# Altium schematic sheet Sheet1 V2.SchDoc
size A3; Date: 04.01.2021; Organization: Altium Limited; Address1: L3, 12a Rodborough Rd; Address2: Frenchs Forest; Address3: NSW; Address4: Australia 2086; SheetNumber: 1; SheetTotal: 2; Version: 1; Название устройства: TSAL_Main_Board
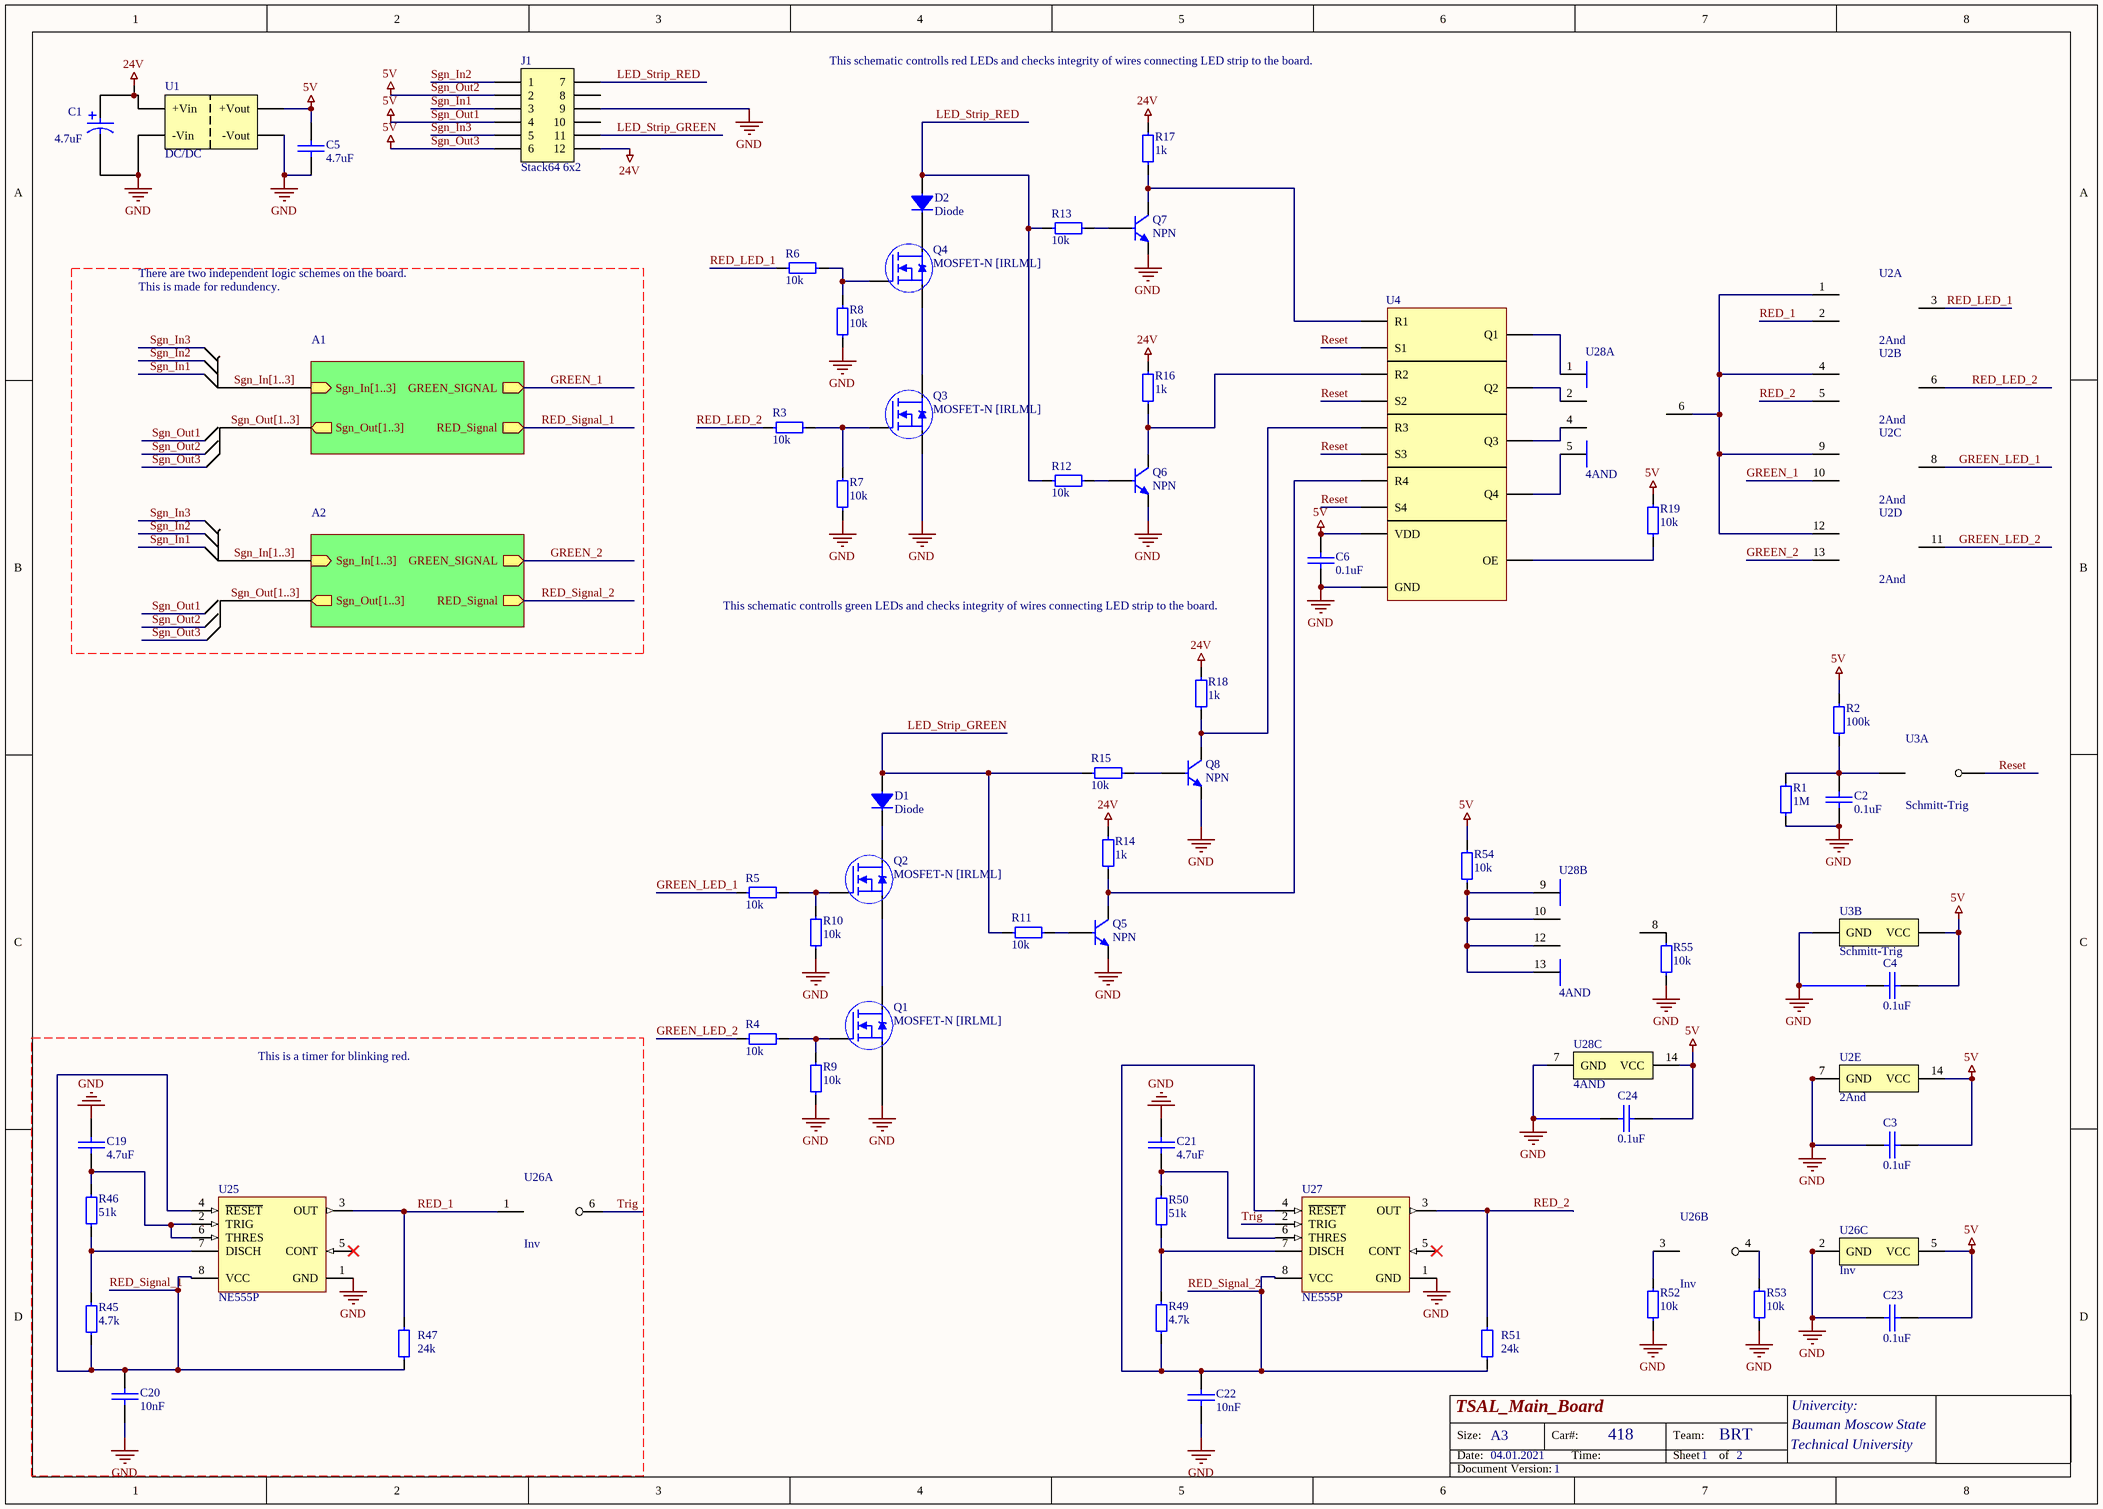
[diagram p0: Sheet1 V2.SchDoc]

## Parts
C1  4.7uF  [Bar Cap 4x5.4]
C2  0.1uF  [0603 Capicator]
C3  0.1uF  [0603 Capicator]
C4  0.1uF  [0603 Capicator]
C5  4.7uF  [0603 Capicator]
C6  0.1uF  [0603 Capicator]
C19  4.7uF  [0603 Capicator]
C20  10nF  [0603 Capicator]
C21  4.7uF  [0603 Capicator]
C22  10nF  [0603 Capicator]
C23  0.1uF  [0603 Capicator]
C24  0.1uF  [0603 Capicator]
D1  Diode  [DO-214AB(SMC)]
D2  Diode  [DO-214AB(SMC)]
J1  Stack64 6x2  [Conn6x2(Molex)]
Q1  MOSFET-N [IRLML]  [SOT-23]
Q2  MOSFET-N [IRLML]  [SOT-23]
Q3  MOSFET-N [IRLML]  [SOT-23]
Q4  MOSFET-N [IRLML]  [SOT-23]
Q5  NPN  [SOT-23]
Q6  NPN  [SOT-23]
Q7  NPN  [SOT-23]
Q8  NPN  [SOT-23]
R1  1M  [0603 Resistor]
R2  100k  [0603 Resistor]
R3  10k  [0603 Resistor]
R4  10k  [0603 Resistor]
R5  10k  [0603 Resistor]
R6  10k  [0603 Resistor]
R7  10k  [0603 Resistor]
R8  10k  [0603 Resistor]
R9  10k  [0603 Resistor]
R10  10k  [0603 Resistor]
R11  10k  [0603 Resistor]
R12  10k  [0603 Resistor]
R13  10k  [0603 Resistor]
R14  1k  [0603 Resistor]
R15  10k  [0805 Resistor]
R16  1k  [0603 Resistor]
R17  1k  [0603 Resistor]
R18  1k  [0603 Resistor]
R19  10k  [0603 Resistor]
R45  4.7k  [0603 Resistor]
R46  51k  [0603 Resistor]
R47  24k  [0805 Resistor]
R49  4.7k  [0603 Resistor]
R50  51k  [0603 Resistor]
R51  24k  [0805 Resistor]
R52  10k  [0603 Resistor]
R53  10k  [0603 Resistor]
R54  10k  [0603 Resistor]
R55  10k  [0603 Resistor]
U1  DC/DC  [SIP7]
U2  2And  [SOIC-14]  (parts A,B,C,D,E of 5)
U3  Schmitt-Trig  [SOT-23-5]  (parts A,B of 2)
U4  quad R/S latch with 3-state outputs  [SOIC-16]  (value not drawn)
U25  NE555P  [SOIC-8]
U26  Inv  [SOT236]  (parts A,B,C of 3)
U27  NE555P  [SOIC-8]
U28  4AND  [SOIC-14]  (parts A,B,C of 3)

## Sub-sheets
A1 = SignalReciever.SchDoc: RED_Signal (out), GREEN_SIGNAL (out), Sgn_In[1..3] (in), Sgn_Out[1..3] (out)
A2 = SignalReciever.SchDoc: RED_Signal (out), GREEN_SIGNAL (out), Sgn_In[1..3] (in), Sgn_Out[1..3] (out)

## Nets
24V: C1.2 J1.12 R14.2 R16.2 R17.2 R18.2 U1.1(+Vin)
GND: C1.1 C2.1 C3.1 C4.1 C5.1 C6.1 C19.2 C20.1 C21.2 C22.1 C23.1 C24.1 J1.9 Q1.2(Source) Q3.2(Source) Q5.2 Q6.2 Q7.2 Q8.2 R1.1 R7.1 R8.1 R9.1 R10.1 R52.1 R53.2 R55.2 U1.2(-Vin) U1.4(-Vout) U2.7(GND) U3.3(GND) U4.16(GND) U25.1(GND) U26.2(GND) U27.1(GND) U28.7(GND)
Sgn_Out1: C3.2 C4.2 C5.2 C6.2 C23.2 C24.2 J1.2 J1.4 J1.6 R2.2 R19.1 R54.1 U1.6(+Vout) U2.14(VCC) U3.5(VCC) U4.8(VDD) U26.5(VCC) U28.14(VCC)  [also labelled 5V, Sgn_Out2, Sgn_Out3]
GREEN_1: U2.10(3B) ; sheet A1/GREEN_SIGNAL
GREEN_2: U2.13(4B) ; sheet A2/GREEN_SIGNAL
GREEN_LED_1: R5.2 U2.8(3Y)
GREEN_LED_2: R4.2 U2.11(4Y)
LED_Strip_GREEN: D1.1 J1.11 R11.2 R15.2
LED_Strip_RED: D2.1 J1.7 R12.2 R13.2
RED_1: R47.2 U2.2(1B) U25.3(OUT) U26.1(1A)
RED_2: R51.2 U2.5(2B) U27.3(OUT)
RED_LED_1: R6.2 U2.3(1Y)
RED_LED_2: R3.2 U2.6(2Y)
RED_Signal_1: C20.2 R45.1 R47.1 U25.4(~{RESET}) U25.8(VCC) ; sheet A1/RED_Signal
RED_Signal_2: C22.2 R49.1 R51.1 U27.4(~{RESET}) U27.8(VCC) ; sheet A2/RED_Signal
Reset: U3.4(Y) U4.4(S1) U4.6(S2) U4.12(S3) U4.14(S4)
Sgn_In1: J1.3
Sgn_In2: J1.1
Sgn_In3: J1.5
Trig: U26.6(1Y) U27.2(TRIG)
NetC2_2: C2.2 R1.2 R2.1 U3.2(in)
NetC19_1: C19.1 R46.2 U25.2(TRIG) U25.6(THRES)
NetC21_1: C21.1 R50.2 U27.6(THRES)
NetD1_2: D1.2 Q2.3(Drain)
NetD2_2: D2.2 Q4.3(Drain)
NetQ1_1: Q1.1(Gate) R4.1 R9.2
NetQ1_3: Q1.3(Drain) Q2.2(Source)
NetQ2_1: Q2.1(Gate) R5.1 R10.2
NetQ3_1: Q3.1(Gate) R3.1 R7.2
NetQ3_3: Q3.3(Drain) Q4.2(Source)
NetQ4_1: Q4.1(Gate) R6.1 R8.2
NetQ5_1: Q5.1 R11.1
NetQ5_3: Q5.3 R14.1 U4.15(R4)
NetQ6_1: Q6.1 R12.1
NetQ6_3: Q6.3 R16.1 U4.7(R2)
NetQ7_1: Q7.1 R13.1
NetQ7_3: Q7.3 R17.1 U4.3(R1)
NetQ8_1: Q8.1 R15.1
NetQ8_3: Q8.3 R18.1 U4.11(R3)
NetR19_2: R19.2 U4.5(OE)
NetR45_2: R45.2 R46.1 U25.7(DISCH)
NetR49_2: R49.2 R50.1 U27.7(DISCH)
NetR52_2: R52.2 U26.3(2А)
NetR53_1: R53.1 U26.4(2Y)
NetR54_2: R54.2 U28.9(A) U28.10(B) U28.12(C) U28.13(D)
NetR55_1: R55.1 U28.8(Y)
NetU2_1: U2.1(1A) U2.4(2A) U2.9(3A) U2.12(4A) U28.6(Y)
NetU4_1: U4.1(Q4) U28.5(D)
NetU4_2: U4.2(Q1) U28.1(A)
NetU4_9: U4.9(Q2) U28.2(B)
NetU4_10: U4.10(Q3) U28.4(C)

Not connected (* = marked no-connect by the designer): J1 8 10; U25 5(CONT)*; U27 5(CONT)*

## Buses and harness runs
bus Sgn_In[1..3] = sheet A1/Sgn_In[1..3]
bus Sgn_In[1..3] = sheet A2/Sgn_In[1..3]
bus Sgn_Out[1..3] = sheet A1/Sgn_Out[1..3]
bus Sgn_Out[1..3] = sheet A2/Sgn_Out[1..3]

## Notes on the sheet
- This schematic controlls red LEDs and checks integrity of wires connecting LED strip to the board.
- There are two independent logic schemes on the board.
- This is made for redundency.
- (near C6) This schematic controlls green LEDs and checks integrity of wires connecting LED strip to the board.
- This is a timer for blinking red.
- Size:
- Date:
- A3
- Car#:
- Time:
- 418
- Team:
- Sheet
- BRT
- of
- Technical University
- Univercity:
- Bauman Moscow State
- Document Version:

## Library data of the parts
C1 = Cap Pol 4.7uF: ECAP SMD,  35V, 105°C; Part Number: B41121A7475M000; Manufacturer: Epcos; Type: Capacitor; ComponentLink1Description: Chip&Dip; ComponentLink1URL: https://www.chipdip.ru/product/b41121a7475m000
C2-C4 C6 C23 C24 = Cap 0.1uF (0603): 0.1uF X7R 16V 10% 0603; Manufacturer: Murata Manufacturing; Part Number: GRM188R71C104KA01D; Type: Capacitor; ComponentLink1Description: Chip&Dip; ComponentLink1URL: https://www.chipdip.ru/product/grm188r71c104ka01d
C5 C19 C21 = Cap 4.7uF (0603): 4.7uF X5R 25V 10% 0603; Manufacturer: Murata Manufacturing; Part Number: GRM188R61E475KE11D; Type: Capacitor; ComponentLink1Description: Chip&Dip; ComponentLink1URL: https://www.chipdip.ru/product0/9000348448
C20 C22 = Cap 10nF (0603): X7R 10nF 100V 10% 0603; Manufacturer: Murata Manufacturing; Part Number: GRM188R72A103KA01D; Type: Capacitor; ComponentLink1Description: Chip&Dip; ComponentLink1URL: https://www.chipdip.ru/product/grm188r72a103ka01d
D1 D2 = Diode (SMC): 3A 50V, (DO-214AB/SMC); Part Number: GS3A; Manufacturer: Yangzhou Yangjie Electronic Technology; Type: Diode; ComponentLink1Description: DataSheet; ComponentLink1URL: https://static.chipdip.ru/lib/152/DOC001152906.pdf; ComponentLink2Description: Chip&Dip; ComponentLink2URL: https://www.chipdip.ru/product/gs3a
J1 = Conn 12 [Stack64]: Stac64 Right-Angle Header Assembly, 12 Circuits, Polarization A, Black, Tray / Current - Maximum per Contact 10.0A / Voltage - Maximum 500V; ComponentLink1Description: Molex; ComponentLink1URL: https://www.molex.com/molex/products/part-detail/pcb_headers/0346910120; ComponentLink2Description: DataSheet; ComponentLink2URL: https://www.molex.com/webdocs/datasheets/pdf/en-us/0346910120_PCB_HEADERS.pdf
Q1-Q4 = MOSFET-N [IRLML]: VDS 30V,  VGS Max ± 20V, RDS 27-40mΩ,; Part Number: IRLML0030TRPBF; Manufacturer: Infineon Technologies; Type: Transistor; ComponentLink1Description: DataSheet; ComponentLink1URL: https://static.chipdip.ru/lib/300/DOC000300382.pdf; ComponentLink2Description: Chip&Dip; ComponentLink2URL: https://www.chipdip.ru/product/irlml0030trpbf
Q5-Q8 = NPN [BC817]: NPN general-purpose transistors; Part Number: BC817-40,215; Manufacturer: Nexperia; Type: Transistor; ComponentLink1Description: DataSheet; ComponentLink1URL: https://static.chipdip.ru/lib/156/DOC000156781.pdf; ComponentLink2Description: Chip&Dip; ComponentLink2URL: https://www.chipdip.ru/product/bc817-40
R1 = Res 1M (0603): 0.1W 0603 1M, 1%; Part Number: RC0603FR-071ML; Manufacturer: Taiwan; Type: Resistor; ComponentLink1Description: Chip&Dip; ComponentLink1URL: https://www.chipdip.ru/product0/9000079784
R2 = Res 100k (0603): 0.1W 0603 100k, 1%; Part Number: RC0603FR-07100KL; Manufacturer: Taiwan; Type: Resistor; ComponentLink1Description: Chip&Dip; ComponentLink1URL: https://www.chipdip.ru/product0/9000079760
R3-R13 R19 R52-R55 = Res 10k (0603): 0.1W 0603 10k, 1%; Part Number: RC0603FR-0710KL; Manufacturer: Taiwan; Type: Resistor; ComponentLink1Description: Chip&Dip; ComponentLink1URL: https://www.chipdip.ru/product0/9000079736
R14 R16-R18 = Res 1k (0603): 0.1W 0603 1k, 1%; Part Number: RC0603FR-071KL; Manufacturer: Taiwan; Type: Resistor; ComponentLink1Description: Chip&Dip; ComponentLink1URL: https://www.chipdip.ru/product0/9000079676
R15 = Res 10k (0805): 0.125W 0805 10k, 1%; Part Number: RC0805FR-0710KL; Manufacturer: Taiwan; Type: Resistor; ComponentLink1Description: Chip&Dip; ComponentLink1URL: https://www.chipdip.ru/product0/9000079514
R45 R49 = Res 4.7k (0603): 0.1W 0603 4.7k, 1%; Part Number: RC0603FR-074K7L; Manufacturer: Taiwan; Type: Resistor; ComponentLink1Description: Chip&Dip; ComponentLink1URL: https://www.chipdip.ru/product0/9000079728
R46 R50 = Res 51k (0603): 0.1W 0603 51k, 1%; Part Number: RC0603FR-0751KL; Manufacturer: Taiwan; Type: Resistor; ComponentLink1Description: Chip&Dip; ComponentLink1URL: https://www.chipdip.ru/product0/9000079753
R47 R51 = Res 24k (0805): 0.125W 0805 24k, 1%; Part Number: RC0805FR-0724KL; Manufacturer: Taiwan; Type: Resistor; ComponentLink1Description: Chip&Dip; ComponentLink1URL: https://www.chipdip.ru/product0/9000079523
U1 = DC/DC Isolated 24V-5V [TMH]: The TMH series are ultra miniature, isolated 2 Watt DC/DC-converters in a Single-in-Line  package  (SIP); Manufacturer: Traco Power; Part Number: TMH2405S; ComponentLink1Description: Chip&Dip; ComponentLink1URL: https://www.chipdip.ru/product/tmh-2405s; ComponentLink2Description: DataSheet; ComponentLink2URL: https://static.chipdip.ru/lib/005/DOC001005854.pdf; Type: IC
U2 = 4(2And): 4 logic elements "2AND"; Part Number: SN74AC08DR; Manufacturer: Texas Instruments; ComponentLink1Description: DataSheet; ComponentLink1URL: https://static.chipdip.ru/lib/551/DOC001551527.pdf; ComponentLink2Description: Chip&Dip; ComponentLink2URL: https://www.chipdip.ru/product/sn74ac08dr; Type: IC
U3 = Schmitt Trigger [NC7SZ]: The NC7SZ14M5X is a single Inverter with Schmitt-trigger input from ultra-high speed (UHS) series of TinyLogic®. The device is fabricated with advanced CMOS technology to achieve ultra-high speed with high output drive while maintaining low static power dissipation over a very broad VCC operating range. The device is specified to operate over the 1.65 to 5.5V VCC range. The inputs and outputs are high-impedance when VCC is 0V. Inputs tolerate voltages up to 6V independent of VCC operating voltage.; Manufacturer: ON Semiconductor; Part Number: NC7SZ14M5X; ComponentLink1Description: DataSheet; ComponentLink1URL: https://static.chipdip.ru/lib/321/DOC000321280.pdf; ComponentLink2Description: Chip&Dip; ComponentLink2URL: https://www.chipdip.ru/product/nc7sz14m5x; Type: IC
U4 = 4 RS triggers: The HEF4043B is a quad R/S latch with 3-state outputs and common output enable input (OE).; ComponentLink1Description: Datasheet; ComponentLink1URL: https://static.chipdip.ru/lib/486/DOC014486419.pdf; ComponentLink2Description: CHIPDIP; ComponentLink2URL: https://www.chipdip.ru/product/hef4043bt-652-nexperia
U25 U27 = NE555P: Standard Timer Single 8-Pin PDIP Tube; Manufacturer: Texas Instruments; Min Supply Voltage: 4.5V; Max Supply Voltage: 16V; Frequency: 500kHz; Number of Timers/Counters: 1; High Level Output Current: -200mA; Low Level Output Current: 200mA; Nominal Supply Current: 2mA; Operating Supply Current: 10mA; Quiescent Current: 15mA; Operating Supply Voltage: 5V; Supplier 1: Digi-Key; Manufacturer Part Number: NE555P; RoHS: Yes; Category: Clock and Timing; Pricing 1: 1=0,37000, 10=0,29900, 25=0,27360, 100=0,20350, 250=0,18444, 500=0,15264, 1000=0,11448, 2500=0,10494, 5000=0,10020 (USD); Mount: SMD; Case/Package: PDIP; Number of Pins: 8; Weight: 0.015535oz; Contact Plating: Gold; Min Operating Temperature: 0°C; Max Operating Temperature: 70°C; Packaging: Rail/Tube; Package Quantity: 50; Current Rating: 10mA; Length: 9.81mm; Width: 6.35mm; Height: 4.57mm; Radiation Hardening: No; Lead Free: Lead Free; RoHS Compliant: Yes; REACH SVHC: No SVHC; ComponentLink1URL: https://datasheet.ciiva.com/1139/sa555-1139904.pdf?src-supplier=Element14; ComponentLink1Description: https://datasheet.ciiva.com/1139/sa555-1139904.pdf?src-supplier=Element14; ComponentLink2URL: https://datasheet.ciiva.com/19457/904085-19457361.pdf?src-supplier=Jameco; ComponentLink2Description: https://datasheet.ciiva.com/19457/904085-19457361.pdf?src-supplier=Jameco; ComponentLink3URL: https://datasheet.ciiva.com/26325/152184-da-01-en-ne555p-timer-tid-26325915.pdf?src-supplier=Conrad; ComponentLink3Description: https://datasheet.ciiva.com/26325/152184-da-01-en-ne555p-timer-tid-26325915.pdf?src-supplier=Conrad; ComponentLink4URL: https://datasheet.ciiva.com/1147/1764032-1147750.pdf?src-supplier=Newark; ComponentLink4Description: https://datasheet.ciiva.com/1147/1764032-1147750.pdf?src-supplier=Newark; ComponentLink5URL: https://datasheet.ciiva.com/14094/ne555-series-eng-tds-14094950.pdf?src-supplier=Distrelec; ComponentLink5Description: https://datasheet.ciiva.com/14094/ne555-series-eng-tds-14094950.pdf?src-supplier=Distrelec; ComponentLink6URL: https://datasheet.ciiva.com/14274/ne555-14274456.pdf?src-supplier=Avnet; ComponentLink6Description: https://datasheet.ciiva.com/14274/ne555-14274456.pdf?src-supplier=Avnet; ComponentLink7URL: https://datasheet.ciiva.com/15152/getdatasheetpartid-248510-15152620.pdf?src-supplier=Verical; ComponentLink7Description: https://datasheet.ciiva.com/15152/getdatasheetpartid-248510-15152620.pdf?src-supplier=Verical; ComponentLink8URL: https://datasheet.ciiva.com/1233/ne555-1233454.pdf?src-supplier=Digi-Key; ComponentLink8Description: https://datasheet.ciiva.com/1233/ne555-1233454.pdf?src-supplier=Digi-Key; ComponentLink9URL: https://datasheet.ciiva.com/26228/ne555-26228892.pdf?src-supplier=Avnet+Europe; ComponentLink9Description: https://datasheet.ciiva.com/26228/ne555-26228892.pdf?src-supplier=Avnet+Europe
U26 = Inverter (SN74): Dual inverter, 1.65-5.5V; Manufacturer: Texas Instruments; Part Number: SN74LVC2G04DBVR; ComponentLink1Description: Chip&Dip; ComponentLink1URL: https://www.chipdip.ru/product/sn74lvc2g04dbvr-2; ComponentLink2Description: DataSheet; ComponentLink2URL: https://static.chipdip.ru/lib/021/DOC001021810.pdf; Type: IC
U28 = 2(4AND): 2 logic elements "4AND"; Part Number: 74HC21D,653; Manufacturer: Nexperia; ComponentLink1Description: Chip&Dip; ComponentLink1URL: https://www.chipdip.ru/product/74hc21d.653; Type: IC; ComponentLink2Description: DataSheet; ComponentLink2URL: https://static.chipdip.ru/lib/522/DOC011522559.pdf